# EAGLE design ps3 (EAGLE 6.5.0)
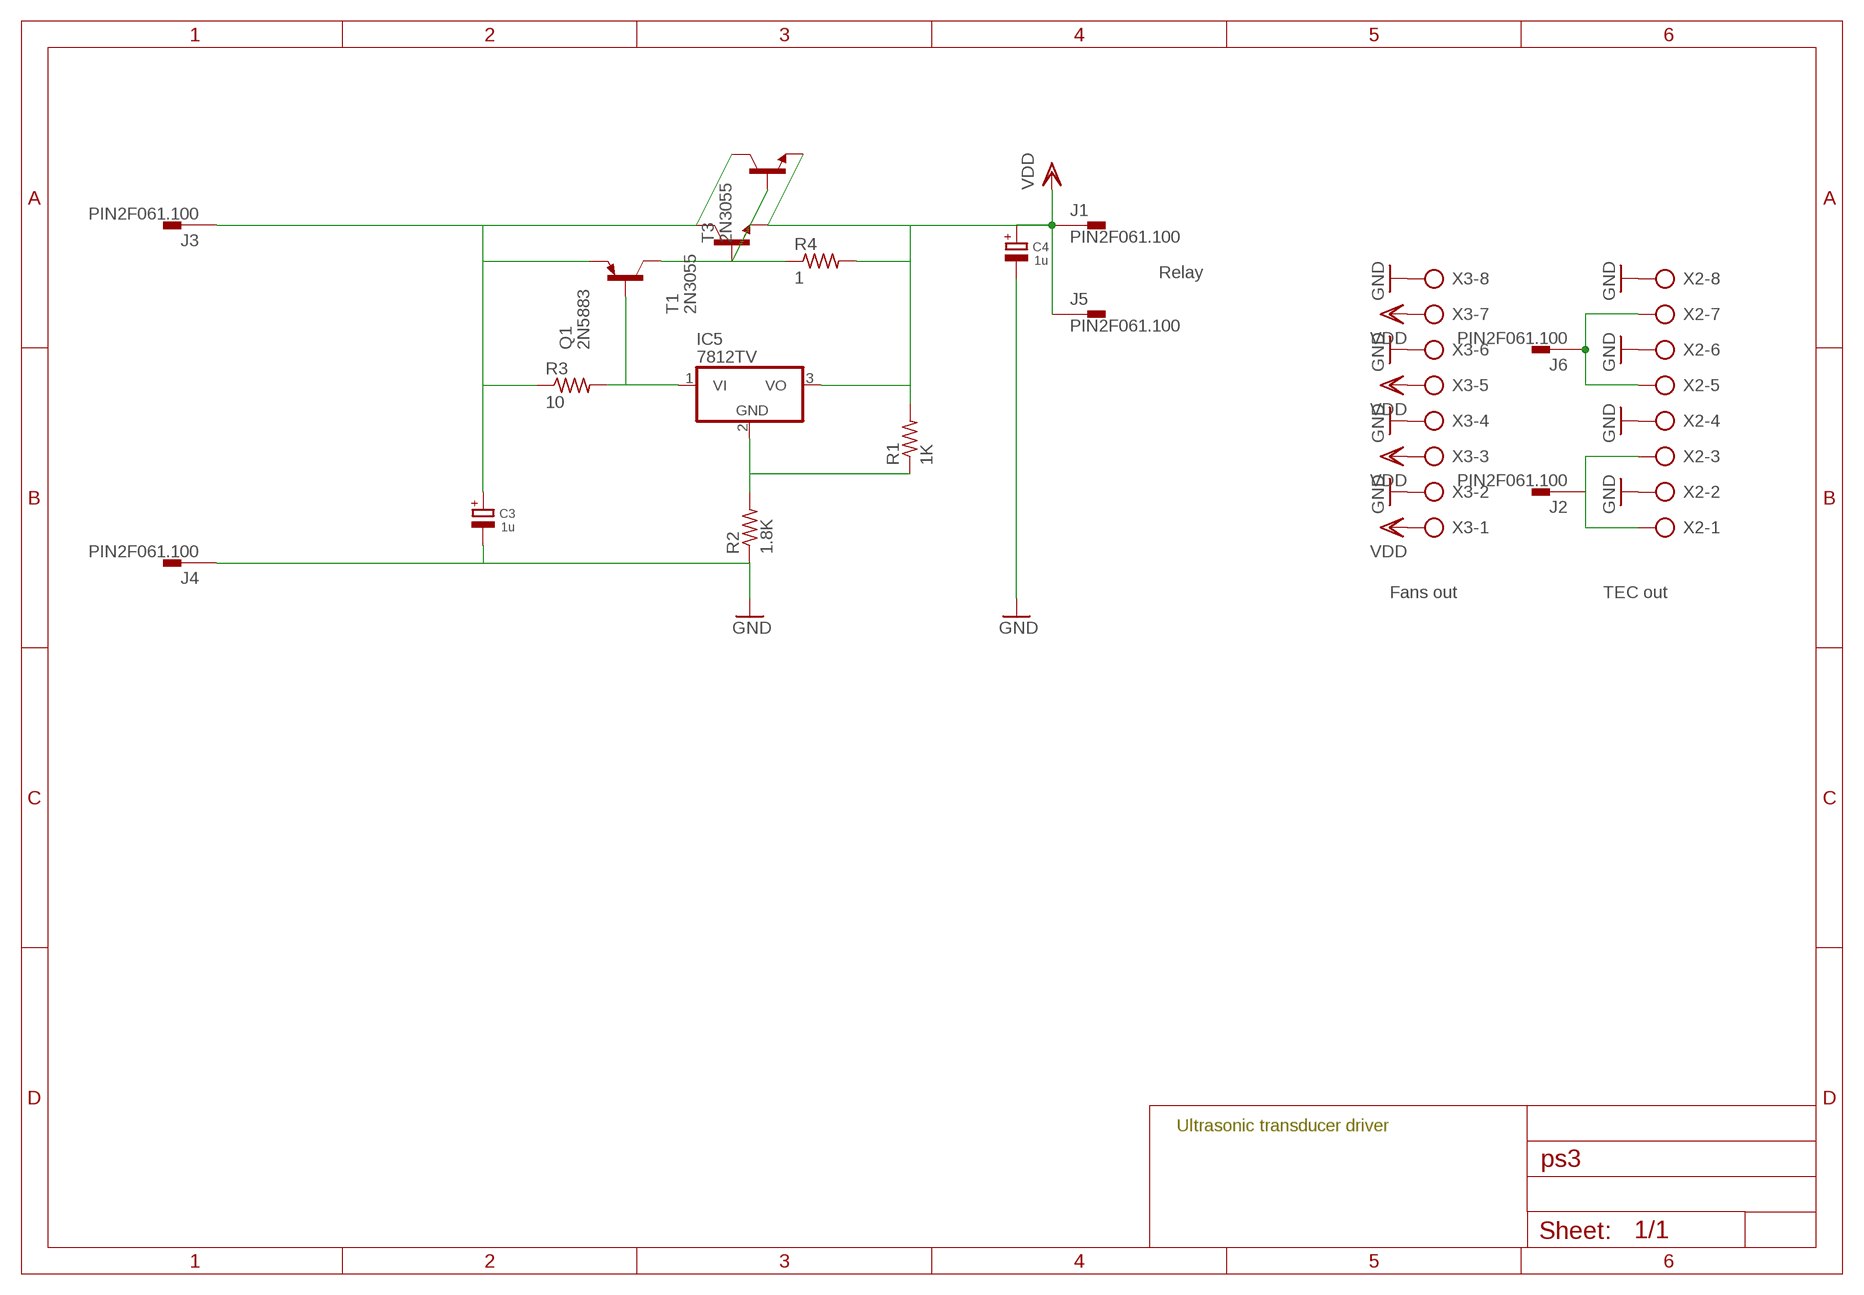
[diagram p0: schematic, sheet 1]

## Parts
C3  1u  CPOL-EUE10-20  [EB20D]
C4  1u  CPOL-EUE10-20  [EB20D]
IC5  7812TV  [TO220V]
J1  PIN2F061.100  [F061.100]
J2  PIN2F061.100  [F061.100]
J3  PIN2F061.100  [F061.100]
J4  PIN2F061.100  [F061.100]
J5  PIN2F061.100  [F061.100]
J6  PIN2F061.100  [F061.100]
Q1  2N5883  2N4905  [TO3]
R1  1K  R-US_0207/15  [0207/15]
R2  1.8K  R-US_0207/15  [0207/15]
R3  10  R-US_0207/15  [0207/15]
R4  1  R-US_0922/22  [0922/22]
T1  2N3055  [TO3]
T3  2N3055  [TO3]
X2  AK300/8  [AK300/8]
X3  AK300/8  [AK300/8]

## Nets
B: Q1.C Q1.C/(C) R4.1 T1.B T3.B
GND: C3.- C4.- J4.A1 J4.A2 R2.1 X2.2 X2.4 X2.6 X2.8 X3.2 X3.4 X3.6 X3.8
N$5: IC5.2(GND) R1.1 R2.2
TEC1: J2.A1 J2.A2 X2.1 X2.3
TEC2: J6.A1 J6.A2 X2.5 X2.7
VDD: C4.+ IC5.3(VO) J1.A1 J1.A2 J5.A1 J5.A2 R1.2 R4.2 T1.E T3.E X3.1 X3.3 X3.5 X3.7
VI: IC5.1(VI) Q1.B R3.2
VIN: C3.+ J3.A1 J3.A2 Q1.E R3.1 T1.C T1.C/(C) T3.C T3.C/(C)

## Notes on the sheet
- Relay
- Fans out | TEC out
- Ultrasonic transducer driver

## Library data of the parts
C3 C4 = rcl:CPOL-EU: POLARIZED CAPACITOR, European symbol
IC5 = linear:78*: Positive VOLTAGE REGULATOR Source: http://cache.national.com/ds/LM/LM78L05.pdf http://www.fairchildsemi.com/ds/LM/LM7805.pdf
J1-J6 = con-faston:PIN2: Flachstecker Typ Tyco/Electronics/AMP TAB, FASTON Printed Circuit Board Tabs Source: http://www.buerklin.com, http://catalog.tycoelectronics.com; OC_FARNELL: unknown; OC_NEWARK: unknown
Q1 = transistor-pnp:2N4905: PNP Transistor
R1-R4 = rcl:R-US_: RESISTOR, American symbol
T1 T3 = transistor:2N3055: NPN TRANSISTOR
X2 X3 = con-ptr500:AK300/8: CONNECTOR; OC_FARNELL: unknown; OC_NEWARK: unknown

## Board
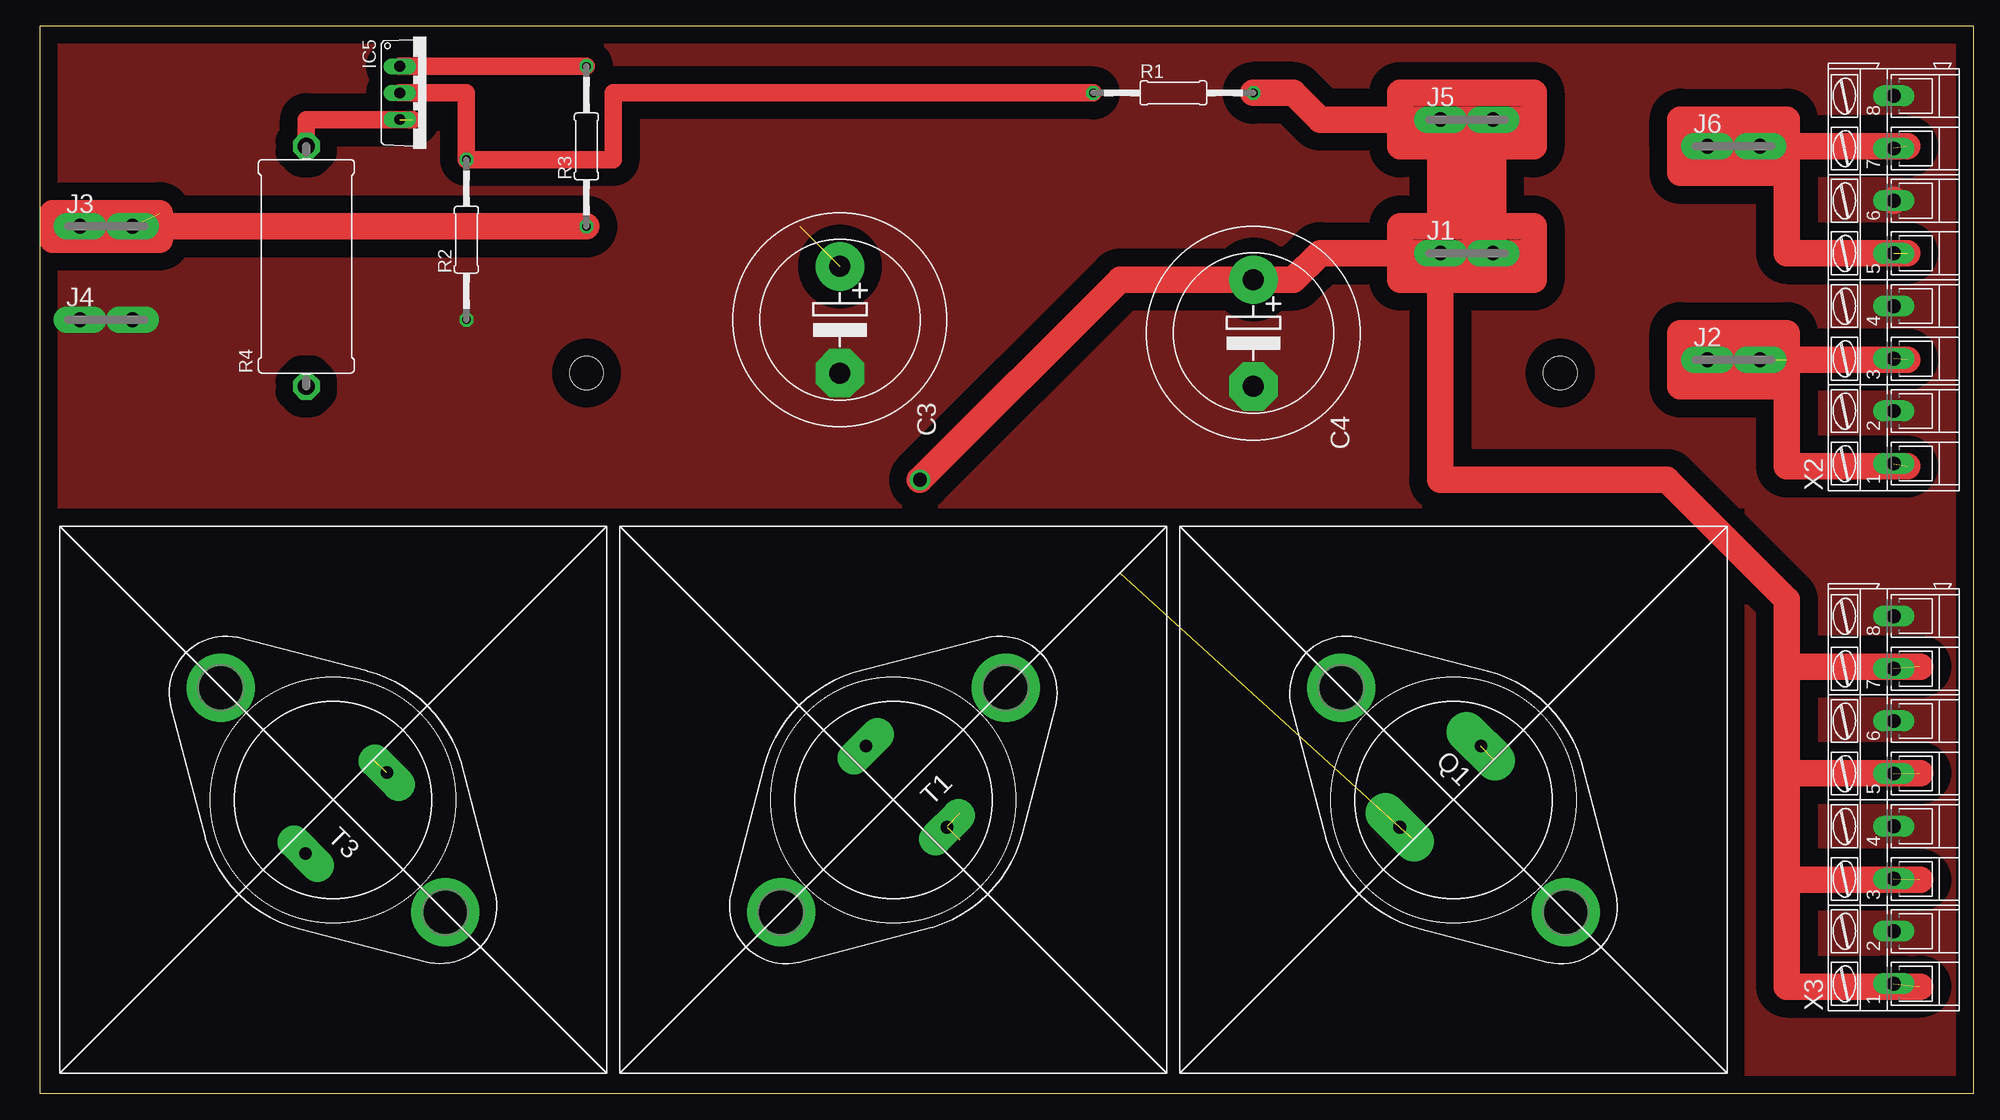
[diagram p1: board, top side]
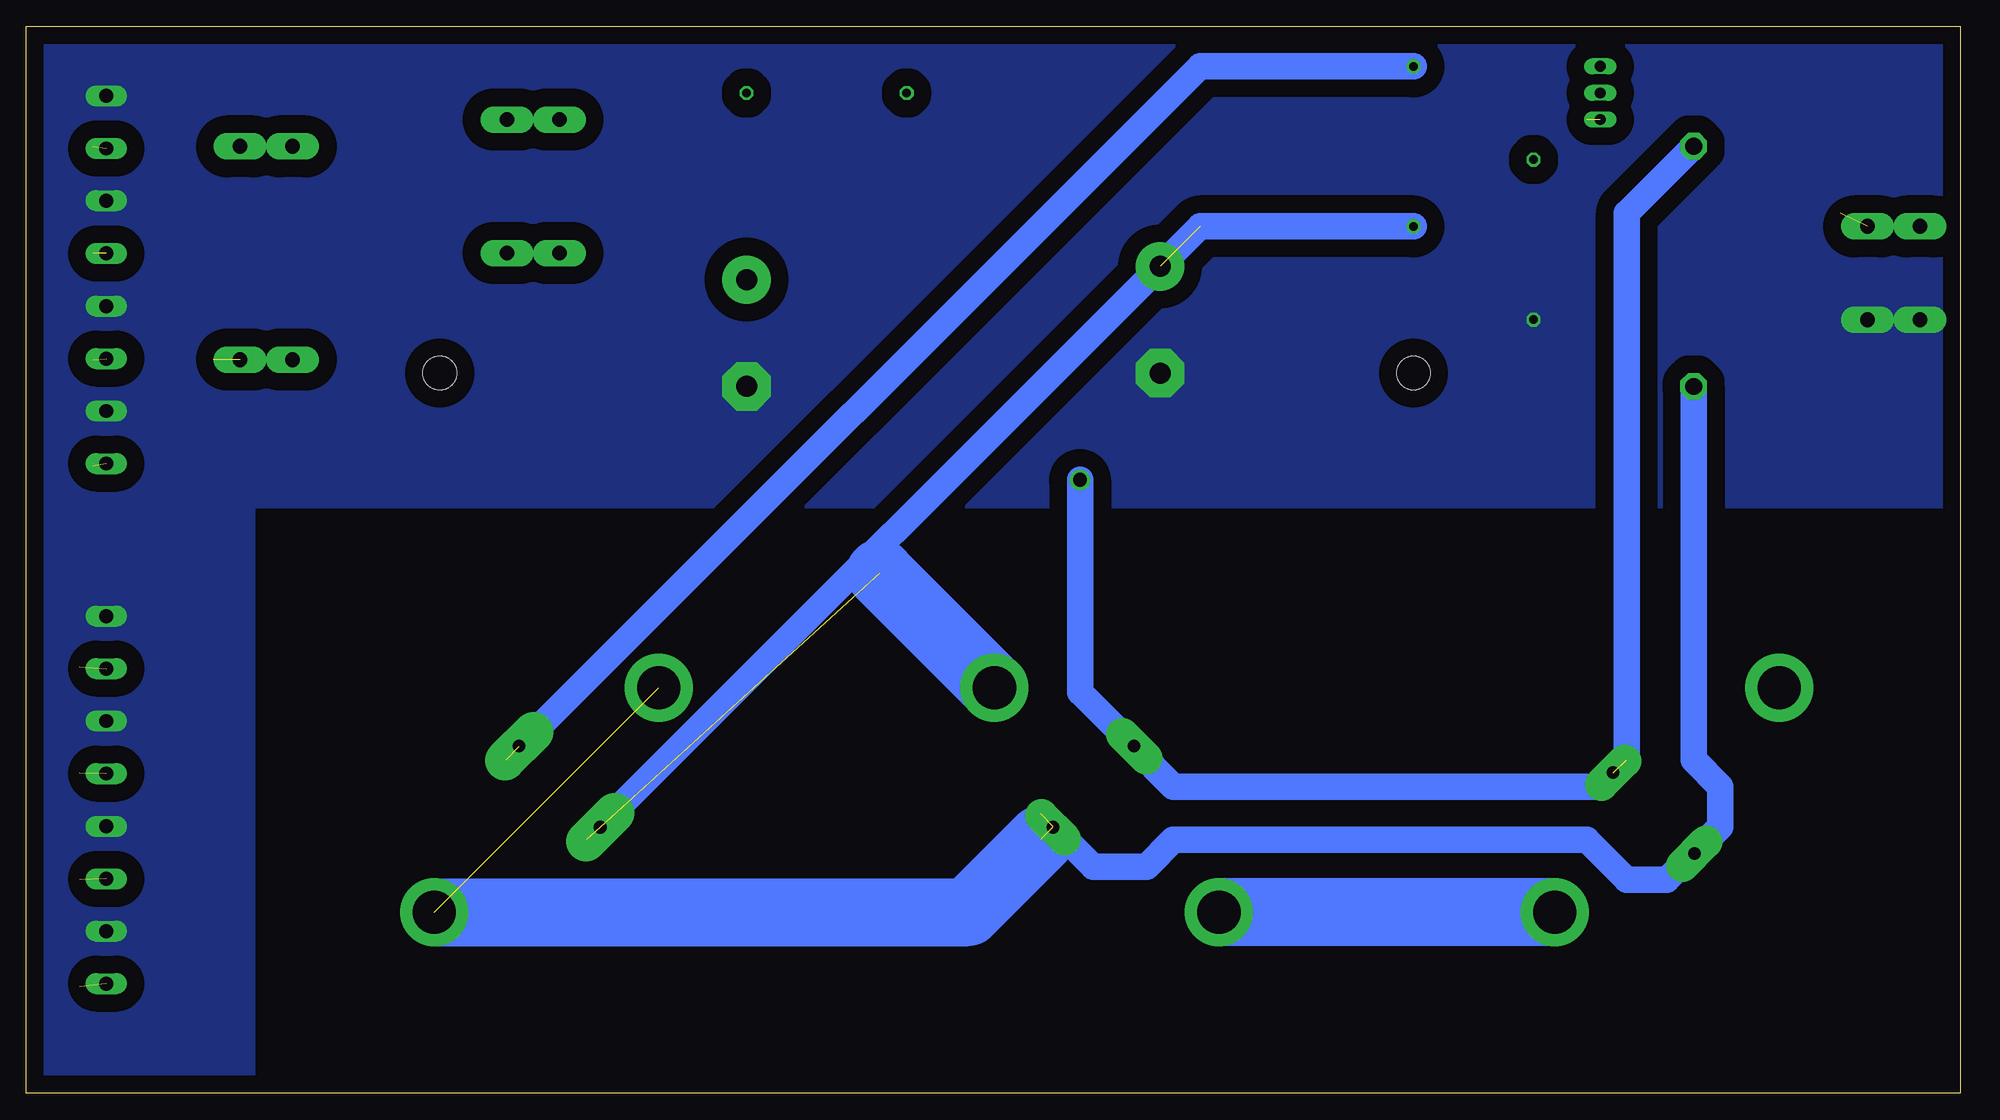
[diagram p2: board, bottom side, seen from below]

Size 184.15 x 101.6 mm. Coordinates in mm from the lower left corner, seen from the top.
Outline: 0,0 184.15,0 184.15,101.6 0,101.6 0,0
Copper layers (1*16): Top 0.035mm / dielectric 1.5mm / Bottom 0.035mm
Design rules "default": minimum track width 10mil, minimum drill 24mil, track to track 8mil, track to pad 8mil, pad to pad 8mil, via to via 8mil, smd to smd 8mil, copper to edge 40mil, drill to drill 8mil, minimum pad ring 10mil, minimum via ring 8mil, stop-mask expansion 4mil, vias tented up to drill 0mil, thermal gap 10mil
Holes 3.2 mm at 52.07,68.58 144.78,68.58

### Footprints (pad centres in the part's own frame; a part is rotated, then mirrored left to right if it is on the bottom)
EB20D = drill 2.007 pad 4.597: + -5.08,0 | drill 2.007 pad 4.597 octagon: - 5.08,0
TO220V = drill 1.016 long: 1 -2.54,-2.54; 2 0,-2.54; 3 2.54,-2.54
F061.100 = drill 1.4 pad 2.54 long: A1 -2.5,0; A2 2.5,0
TO3 = drill 1.194 pad 3.81 long: B -1.778,5.461; E -1.778,-5.461 | drill 4.115 pad 6.477: C 15.113,0; C/ -15.113,0
0207/15 = drill 0.813 octagon: 1 -7.62,0; 2 7.62,0
0922/22 = drill 1.6 pad 2.54 octagon: 1 -11.43,0; 2 11.43,0
TO3' = drill 1.194 pad 3.15 long: B -1.778,5.461; E -1.778,-5.461 | drill 4.115 pad 6.477: C 15.113,0; C/ -15.113,0
AK300/8 = drill 1.321 long: 1 -17.501,0; 2 -12.497,0; 3 -7.518,0; 4 -2.515,0; 5 2.515,0; 6 7.518,0; 7 12.497,0; 8 17.501,0

### Placement (x,y rotation side)
C3  76.2,73.66 270 top
C4  115.57,72.39 270 top
IC5  36.83,95.25 270 top
J1  135.89,80.01 0 top
J2  161.29,69.85 0 top
J3  6.35,82.55 0 top
J4  6.35,73.66 0 top
J5  135.89,92.71 0 top
J6  161.29,90.17 0 top
Q1  134.62,27.94 315 top
R1  107.95,95.25 0 top
R2  40.64,81.28 90 top
R3  52.07,90.17 90 top
R4  25.4,78.74 90 top
T1  2N3055  [TO3']  81.28,27.94 225 top
T3  2N3055  [TO3']  27.94,27.94 135 top
X2  176.53,77.47 90 top
X3  176.53,27.94 90 top

### Tracks (layer width: path | path; a pad name or v marks a point on that pad's centre or on a via)
B  (3 unrouted)
  Bottom 2.54: T1.B 86.4,25.44 | R4.1 25.4,31.75 22.86,29.21 22.86,25.4 26.61,21.65 | T3.B 26.61,21.65 | 26.61,21.65 27.94,20.32 31.75,20.32 35.56,24.13 74.93,24.13 77.47,21.59 82.55,21.59 87.63,26.67
  Bottom 6.452: Q1.C 94.48,17.25 94.48,17.28 87.63,24.13
GND
  Top 2.54: 176.53,85.09 X2.6
  pour Top (isolate 1.676, no thermals): 0,101.6 184.15,101.6 184.15,0 162.56,0 162.56,55.88 0,55.88
  pour Bottom (isolate 1.676, no thermals): 0,101.6 184.15,101.6 184.15,0 162.56,0 162.56,55.88 0,55.88
N$5
  Top 1.676: IC5.2 40.64,95.25 R2.2 54.61,88.9 54.61,95.25 R1.1
TEC1  (3 unrouted)
  Top 2.54: 166.37,69.85 J2.A1 156.21,69.85 | 177.8,69.85 166.37,69.85 | 166.37,69.85 166.37,67.31 | 166.37,67.31 166.37,59.69 177.8,59.69 | 156.21,69.85 156.21,67.31 166.37,67.31 | 156.21,69.85 156.21,72.39 166.37,72.39 166.37,69.85
TEC2  (2 unrouted)
  Top 2.54: 166.37,90.17 J6.A2 J6.A1 156.21,90.17 | 177.8,90.17 166.37,90.17 | 166.37,90.17 166.37,87.63 | 166.37,87.63 166.37,80.01 177.8,80.01 | 156.21,90.17 156.21,87.63 166.37,87.63 | 156.21,90.17 156.21,92.71 166.37,92.71 166.37,90.17
VDD  (via drill 1.3)  (6 unrouted)
  Top 1.676: R4.2 25.4,92.71 35.56,92.71
  Top 2.54: v83.82,58.42 102.87,77.47 C4.+ 119.38,77.47 121.92,80.01 J1.A1 J1.A2 | J5.A2 135.89,92.71 | R1.2 119.38,95.25 121.92,92.71 J5.A1 135.89,92.71 | J1.A2 138.43,80.01 | J1.A2 142.24,80.01 | 142.24,80.01 142.24,77.47 140.97,77.47 | 140.97,77.47 129.54,77.47 129.54,82.55 135.89,82.55 | 135.89,82.55 142.24,82.55 142.24,80.01 | J5.A2 142.24,92.71 | 142.24,92.71 142.24,90.17 138.43,90.17 | 138.43,90.17 135.89,90.17 | 133.35,90.17 129.54,90.17 129.54,95.25 142.24,95.25 142.24,92.71 | 138.43,90.17 135.89,92.71 | J1.A2 J5.A2 | 140.97,77.47 135.89,82.55 | 135.89,82.55 135.89,90.17 | 135.89,90.17 133.35,90.17 | 133.35,90.17 133.35,58.42 154.94,58.42 166.37,46.99 166.37,40.64 | 179.07,40.64 166.37,40.64 | 166.37,40.64 166.37,30.48 | 179.07,30.48 166.37,30.48 | 166.37,30.48 166.37,20.32 | 179.07,20.32 166.37,20.32 | 166.37,20.32 166.37,10.16 179.07,10.16
  Bottom 2.54: v83.82,58.42 83.82,38.2 T1.E 78.68,32.96 74.93,29.21 34.29,29.21 31.75,31.75 31.75,83.82 R4.2
VI  (1 unrouted)
  Top 1.676: IC5.1 R3.2
  Bottom 2.54: R3.2 72.39,97.79 138.43,31.75
VIN  (4 unrouted)
  Top 2.54: R3.1 J3.A1 1.27,82.55 | 1.27,82.55 1.27,83.82 11.43,83.82 11.43,81.28 1.27,81.28 1.27,82.55
  Bottom 2.54: R3.1 72.39,82.55 130.81,24.13
  Bottom 6.452: T3.C/ T1.C | T1.C/ 102.87,49.53